# Altium schematic sheet Design1.SchDoc
size A4; SheetNumber: 1; SheetTotal: 1
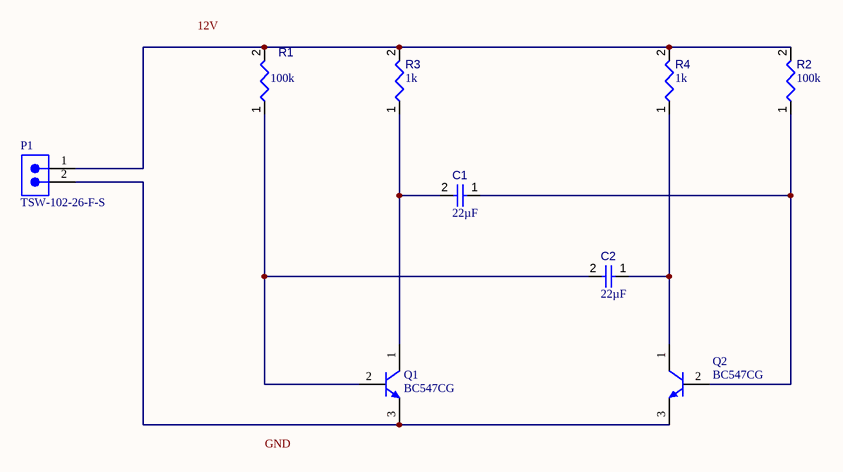
[diagram p0: Design1.SchDoc]

## Parts
C1  value 22µF  [CAPC0805(2012)145_L]  (hidden comment: Capacitor 22µF +/-40% 16V 0805)
C2  value 22µF  [CAPC0805(2012)145_L]  (hidden comment: Capacitor 22µF +/-40% 16V 0805)
P1  TSW-102-26-F-S  [SMTC-TSW-102-26-XX-S]
Q1  BC547CG  [ONSC-TO-92-3-29-11]
Q2  BC547CG  [ONSC-TO-92-3-29-11]
R1  R1: 100k  [RESC1005X40X25ML10T10]  (hidden comment: Resistor 1k +/-5% 0402 63 mW)
R2  value 100k  [RESC1005X40X25ML10T10]  (hidden comment: Resistor 1k +/-5% 0402 63 mW)
R3  value 1k  [RESC1005X40X25ML10T10]  (hidden comment: Resistor 1k +/-5% 0402 63 mW)
R4  value 1k  [RESC1005X40X25ML10T10]  (hidden comment: Resistor 1k +/-5% 0402 63 mW)

## Nets
NetC1_1: C1.1 Q2.2(B) R2.1
NetC1_2: C1.2 Q1.1(C) R3.1
NetC2_1: C2.1 Q2.1(C) R4.1
NetC2_2: C2.2 Q1.2(B) R1.1
NetP1_1: P1.1 R1.2 R2.2 R3.2 R4.2
NetP1_2: P1.2 Q1.3(E) Q2.3(E)

## Notes on the sheet
- Labels drawn without touching a wire or pin: 12V, GND

## Library data of the parts
C1 C2 = CMP-001-00081-4: Chip Capacitor, 22µF +/-5%, 16V, 0603, Thickness 1.45 mm; Tolerance: 5%; Voltage Rating: 16V; Mounting Technology: SMT; Pins: 2; Max Operating Temperature: 85°C; Case/Package: 0805; Min Operating Temperature: -55°C
P1 = CMP-1024-00329-1: 0.025" SQ Post Header, Through-hole, Vertical, -55 to 125 degC, 2.54 mm Pitch, 2-Pin, Male, RoHS; Manufacturer: Samtec; Pitch: 2.54 mm; PackageVersion: DM, 8/1988; ComponentLink2Description: Datasheet; PackageReference: TSW-102-26-XX-S; ComponentLink3URL: http://www.samtec.com/documents/webfiles/cpdf/TSW-XXX-XX-XXX-X-XX-XXX-MKT.pdf; ComponentLink2URL: http://www.samtec.com/documents/webfiles/pdf/TSW_TH.PDF; ComponentLink1Description: Manufacturer URL; DatasheetVersion: F-214; RoHS: True; ComponentLink3Description: Package Specification; PartNumber: TSW-102-26-F-S; Temperature Range: -55 to 125 degC; Orientation: Vertical; ComponentLink1URL: http://www.samtec.com; PackageDescription: .025[0.64] SQ. Post Terminal Strip Assembly; Mounting Technology: Through-hole
Q1 Q2 = CMP-1048-01464-1: Amplifier Transistor, NPN Silicon, 3-Pin TO-92, Pb-Free, Bulk Box; Manufacturer: On Semiconductor; IC Continuous (A): 0.1; fT Min (MHz): 150; ComponentLink3URL: http://www.onsemi.cn/pub_link/Collateral/2N6426-D.PDF; Mounting Technology: Through Hole; PackageReference: TO-92-3-29-11_AM_SL; ComponentLink2Description: Datasheet; RoHS: TRUE; Packing: Bulk Box; ComponentLink1Description: Manufacturer URL; PackageDescription: 3-Pin Transistor Outline, Body 4.825 x 3.685 mm, Pitch 1.27 mm; PackageVersion: Rev. AM; ComponentLink2URL: http://www.onsemi.com/pub_link/Collateral/BC546-D.PDF; ComponentLink3Description: Package Specification; ComponentLink1URL: http://www.onsemi.com/; DatasheetVersion: Rev. 7; Polarity: NPN; PartNumber: BC547CG
R1-R4 = CMP-009-00013-5: Chip Resistor, 1 KOhm, +/- 5%, 0.063 W, -55 to 155 degC, 0402 (1005 Metric); Power: 63mW; Tolerance: 5%; Case/Package: 0402; Mounting Technology: SM; Min Operating Temperature: -55°C; Pins: 2; Max Operating Temperature: 155°C; RoHS Compliant: True